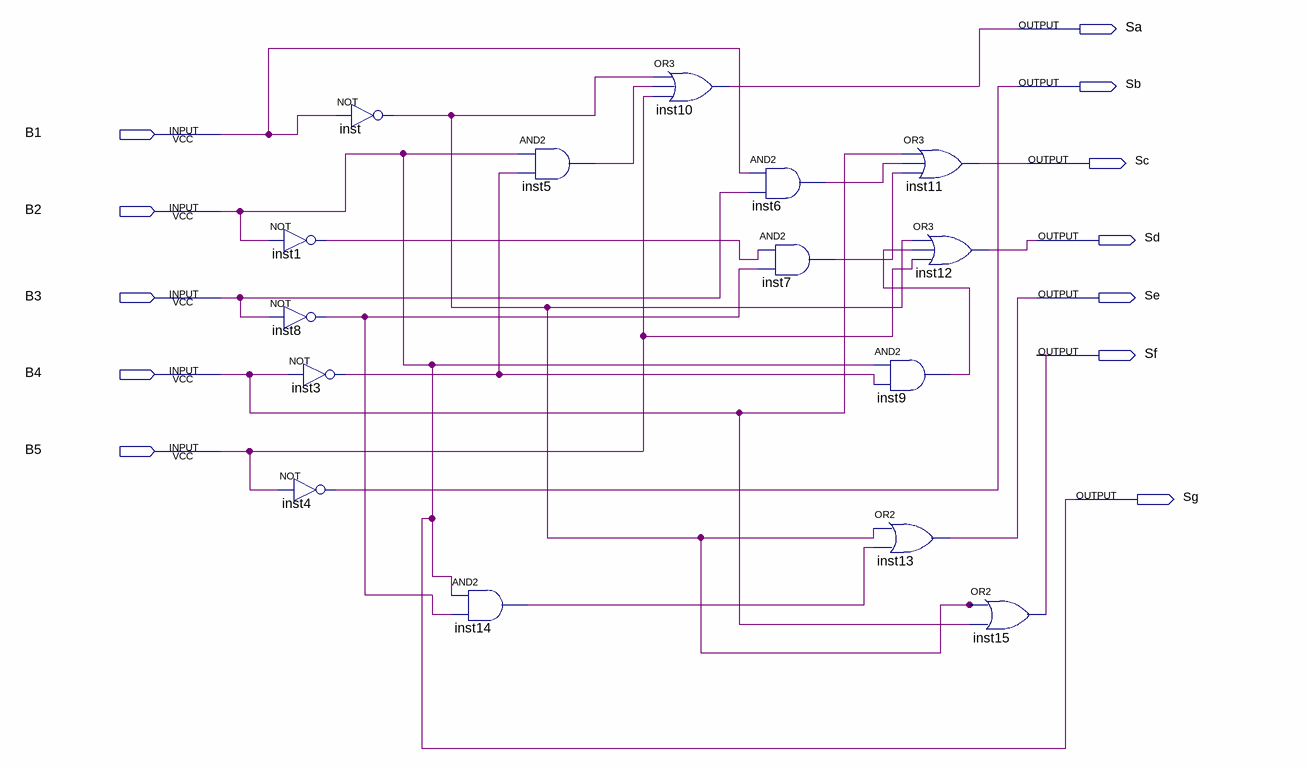
[diagram p0: schematic sheet]
// Quartus schematic decodeur.bdf as structural Verilog: 15 symbols, 12 pins
module decodeur (
  input  B1,
  input  B2,
  input  B3,
  input  B4,
  input  B5,
  output Sa,
  output Sb,
  output Sc,
  output Sd,
  output Se,
  output Sf,
  output Sg
);

  wire inst1_out, inst3_out, inst5_out, inst6_out, inst7_out, inst8_out, inst9_out, inst14_out, inst_out;

  not inst1 (inst1_out, B2);
  not inst8 (inst8_out, B3);
  not inst3 (inst3_out, B4);
  not inst4 (Sb, B5);
  not inst (inst_out, B1);
  and inst14 (inst14_out, B2, inst8_out);
  and inst5 (inst5_out, B2, inst3_out);
  or inst10 (Sa, inst_out, inst5_out, B5);
  and inst6 (inst6_out, B1, B3);
  and inst7 (inst7_out, inst1_out, inst8_out);
  or inst11 (Sc, B4, inst6_out, inst7_out);
  or inst12 (Sd, inst_out, inst9_out, B5);
  and inst9 (inst9_out, B2, inst3_out);
  or inst13 (Se, inst_out, inst14_out);
  or inst15 (Sf, inst_out, B4);

  assign Sg = B2;
endmodule
